# Altium schematic sheet CGA0603X5R106K100JT1_CGA0603X5R106K100JT.schdoc
size 127 x 101 mm
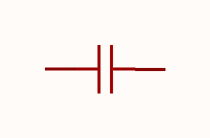
[diagram p0: CGA0603X5R106K100JT1_CGA0603X5R106K100JT.schdoc]

## Parts
C?  10uF  [C0603]  (value not drawn)

## Nets

Not connected (* = marked no-connect by the designer): C? 1 2

## Library data of the parts
C? = CGA0603X5R106K100JT: Manufacturer: HRE(芯声); Add into BOM: yes; Tolerance: ±10%; Voltage Rating: 10V; Temperature Coefficient: X5R; Symbol: CGA0603X5R106K100JT; Device: CGA0603X5R106K100JT; LCSC Part Name: 10uF ±10% 10V; Supplier Part: C6119842; Manufacturer Part: CGA0603X5R106K100JT; Supplier Footprint: 0603; JLCPCB Part Class: Extended Part; Supplier: LCSC; Convert to PCB: yes; Value: 10uF